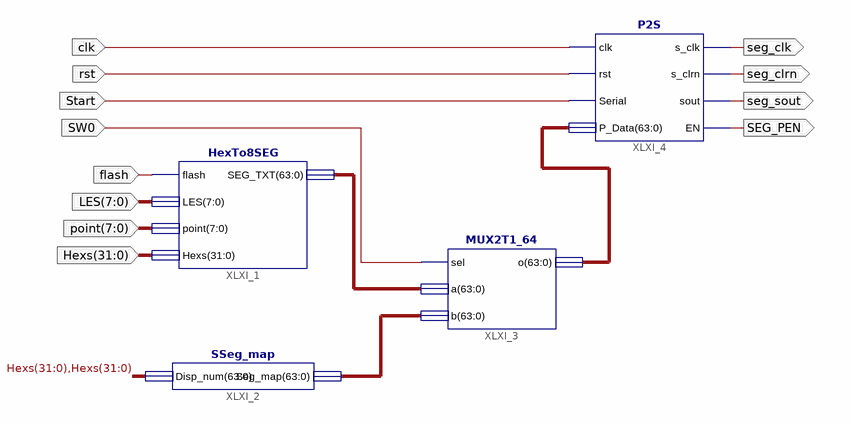
[diagram p0: schematic sheet 1]
// Xilinx ISE schematic SSeg7_Dev.sch (kintex7) as structural Verilog: 4 symbols, 12 ports
module SSeg7_Dev (
  input  clk,
  input  rst,
  input  Start,
  input  SW0,
  input  flash,
  input  [7:0] LES,
  input  [7:0] point,
  input  [31:0] Hexs,
  output seg_clk,
  output seg_clrn,
  output seg_sout,
  output SEG_PEN
);

  wire [63:0] XLXN_14, XLXN_15, XLXN_16;

  HexTo8SEG XLXI_1 (.flash(flash), .LES(LES), .point(point), .Hexs(Hexs), .SEG_TXT(XLXN_14));
  SSeg_map XLXI_2 (.Disp_num({Hexs, Hexs}), .Seg_map(XLXN_15));
  MUX2T1_64 XLXI_3 (.sel(SW0), .a(XLXN_14), .b(XLXN_15), .o(XLXN_16));
  P2S XLXI_4 (
    .clk(clk), .rst(rst), .Serial(Start), .P_Data(XLXN_16), .s_clk(seg_clk), .s_clrn(seg_clrn),
    .sout(seg_sout), .EN(SEG_PEN));
endmodule
